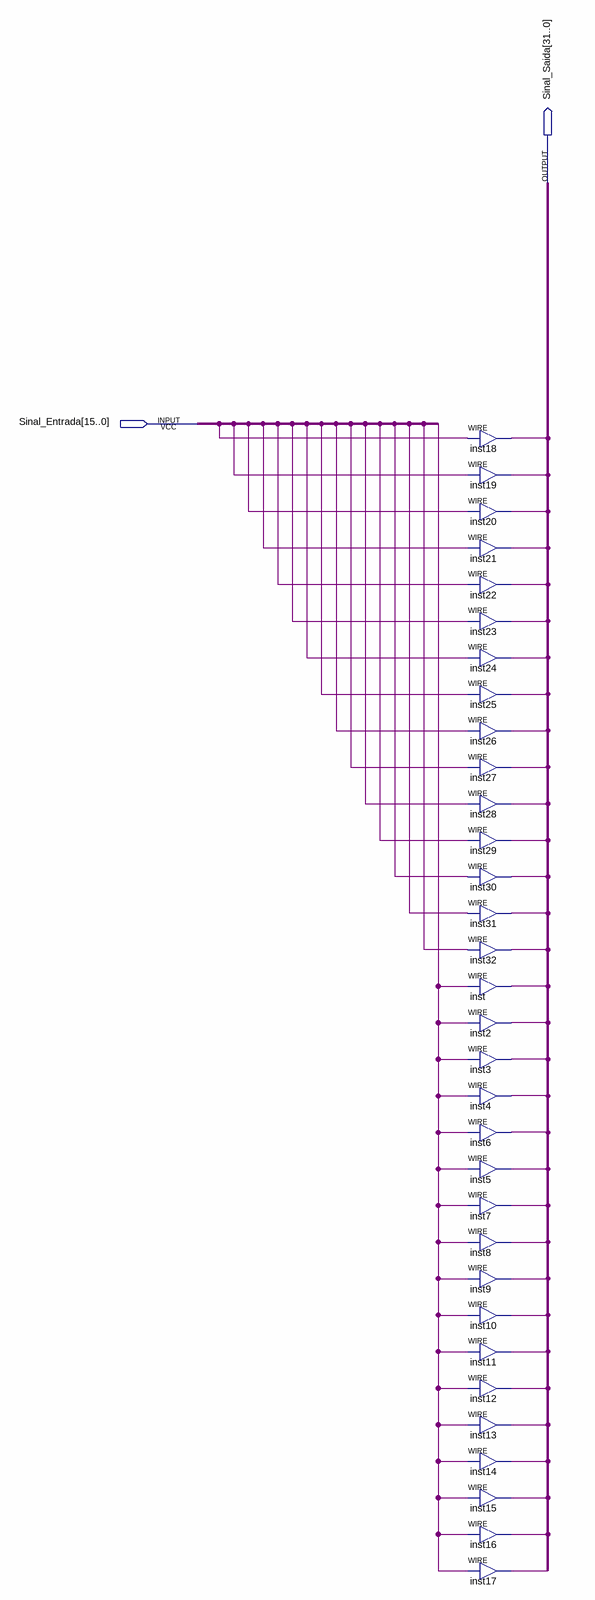
[diagram p0: schematic sheet]
// Quartus schematic EXTSIGN16_to_32.bdf as structural Verilog: 32 symbols, 2 pins
module EXTSIGN16_to_32 (
  input  [15:0] Sinal_Entrada,
  output [31:0] Sinal_Saida
);

  assign Sinal_Saida[0] = Sinal_Entrada[0];  // WIRE inst18
  assign Sinal_Saida[1] = Sinal_Entrada[1];  // WIRE inst19
  assign Sinal_Saida[2] = Sinal_Entrada[2];  // WIRE inst20
  assign Sinal_Saida[3] = Sinal_Entrada[3];  // WIRE inst21
  assign Sinal_Saida[4] = Sinal_Entrada[4];  // WIRE inst22
  assign Sinal_Saida[5] = Sinal_Entrada[5];  // WIRE inst23
  assign Sinal_Saida[6] = Sinal_Entrada[6];  // WIRE inst24
  assign Sinal_Saida[7] = Sinal_Entrada[7];  // WIRE inst25
  assign Sinal_Saida[8] = Sinal_Entrada[8];  // WIRE inst26
  assign Sinal_Saida[9] = Sinal_Entrada[9];  // WIRE inst27
  assign Sinal_Saida[10] = Sinal_Entrada[10];  // WIRE inst28
  assign Sinal_Saida[11] = Sinal_Entrada[11];  // WIRE inst29
  assign Sinal_Saida[12] = Sinal_Entrada[12];  // WIRE inst30
  assign Sinal_Saida[13] = Sinal_Entrada[13];  // WIRE inst31
  assign Sinal_Saida[14] = Sinal_Entrada[14];  // WIRE inst32
  assign Sinal_Saida[15] = Sinal_Entrada[15];  // WIRE inst
  assign Sinal_Saida[16] = Sinal_Entrada[15];  // WIRE inst2
  assign Sinal_Saida[17] = Sinal_Entrada[15];  // WIRE inst3
  assign Sinal_Saida[18] = Sinal_Entrada[15];  // WIRE inst4
  assign Sinal_Saida[19] = Sinal_Entrada[15];  // WIRE inst6
  assign Sinal_Saida[20] = Sinal_Entrada[15];  // WIRE inst5
  assign Sinal_Saida[21] = Sinal_Entrada[15];  // WIRE inst7
  assign Sinal_Saida[22] = Sinal_Entrada[15];  // WIRE inst8
  assign Sinal_Saida[23] = Sinal_Entrada[15];  // WIRE inst9
  assign Sinal_Saida[24] = Sinal_Entrada[15];  // WIRE inst10
  assign Sinal_Saida[25] = Sinal_Entrada[15];  // WIRE inst11
  assign Sinal_Saida[26] = Sinal_Entrada[15];  // WIRE inst12
  assign Sinal_Saida[27] = Sinal_Entrada[15];  // WIRE inst13
  assign Sinal_Saida[28] = Sinal_Entrada[15];  // WIRE inst14
  assign Sinal_Saida[29] = Sinal_Entrada[15];  // WIRE inst15
  assign Sinal_Saida[30] = Sinal_Entrada[15];  // WIRE inst16
  assign Sinal_Saida[31] = Sinal_Entrada[15];  // WIRE inst17
endmodule
